# Altium project ludi_v1.PrjPcb
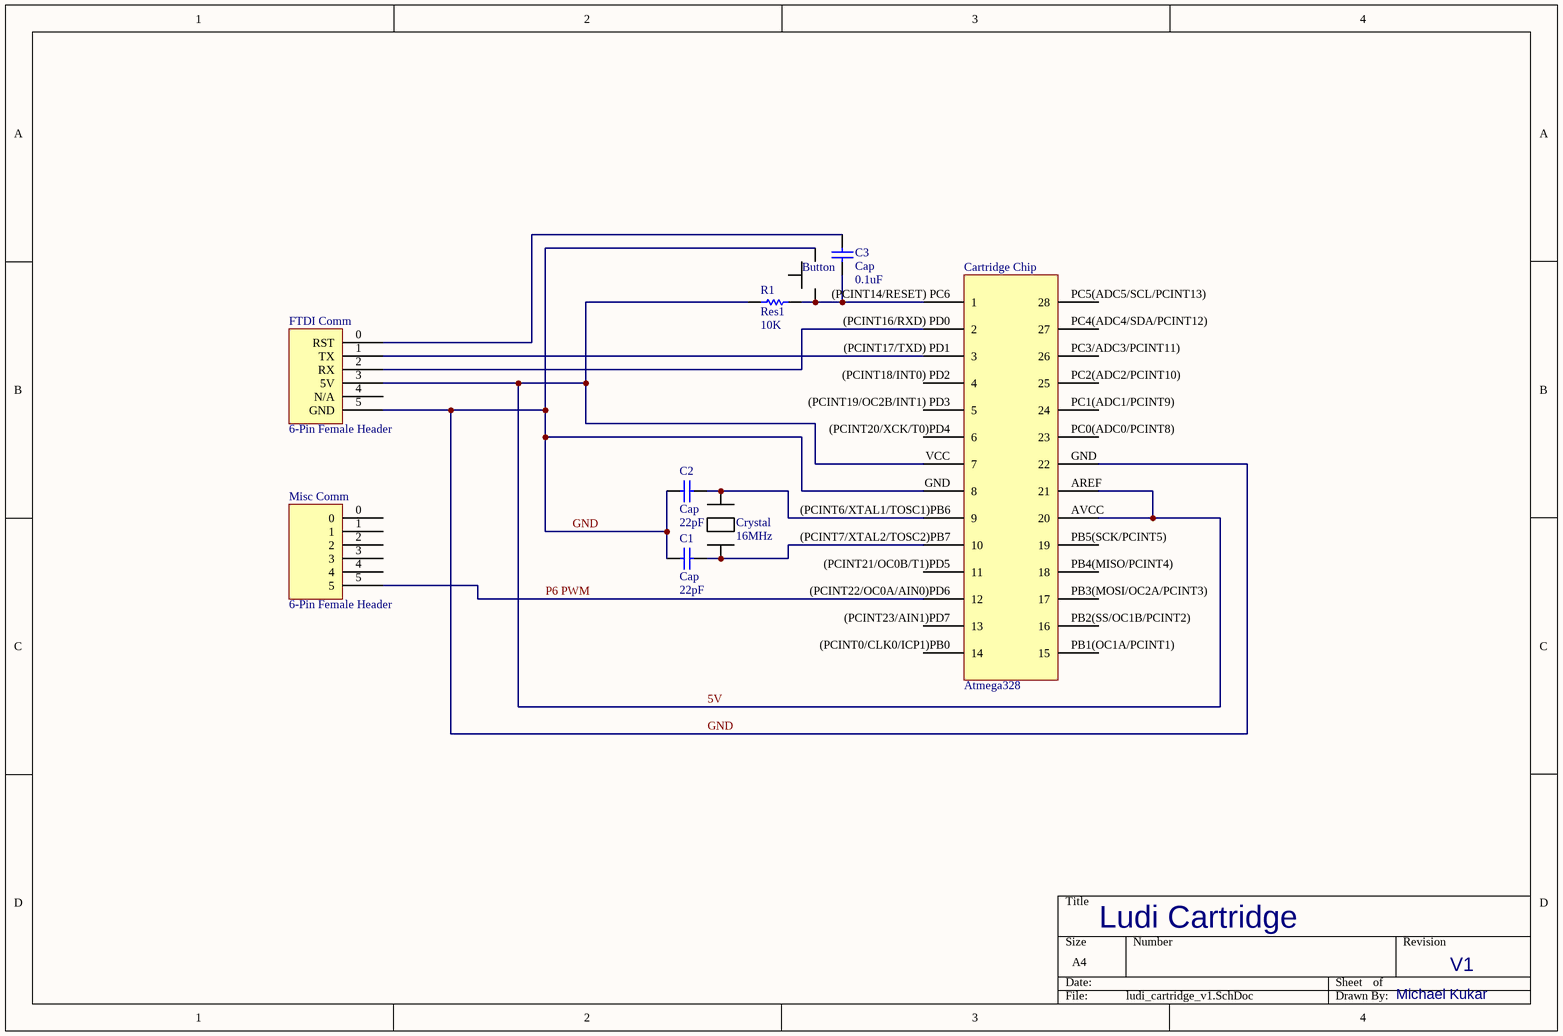
[diagram p0: ludi_cartridge_v1.SchDoc]
2 sheets, 9 parts. Net scope: global (net labels, ports and power ports of the same name join across sheets).
Sheets:
  ludi_console_v1.SchDoc
  ludi_cartridge_v1.SchDoc

## Sheet ludi_console_v1.SchDoc
size A4

## Sheet ludi_cartridge_v1.SchDoc
size A4

### Parts
*  Crystal  Frequency: 16MHz
Button  Momentary Button - Normally Open  (value not drawn)
C1  Cap  value 22pF  [RAD-0.3]
C2  Cap  value 22pF  [RAD-0.3]
C3  Cap  value 0.1uF  [RAD-0.3]
Cartridge_Chip  Atmega328
FTDI_Comm  6-Pin Female Header
Misc_Comm  6-Pin Female Header
R1  Res1  value 10K  [AXIAL-0.3]

### Nets
5V: Cartridge_Chip.AREF(21) Cartridge_Chip.AVCC(20) Cartridge_Chip.VCC(7) FTDI_Comm.3(5V) R1.1
GND: Button.1 C1.1 C2.1 Cartridge_Chip.GND(8) FTDI_Comm.5(GND)
P6 PWM: Cartridge_Chip.(PCINT22/OC0A/AIN0)PD6(12) Misc_Comm.5
Net*_0: *.0 C1.2 Cartridge_Chip.(PCINT7/XTAL2/TOSC2)PB7(10)
Net*_1: *.1 C2.2 Cartridge_Chip.(PCINT6/XTAL1/TOSC1)PB6(9)
NetButton_0: Button.0 C3.1 Cartridge_Chip.(PCINT14/RESET)_PC6(1) R1.2
NetC3_2: C3.2 FTDI_Comm.0(RST)
NetCartridge_Chip_(PCINT16/RXD) PD0: Cartridge_Chip.(PCINT16/RXD)_PD0(2) FTDI_Comm.2(RX)
NetCartridge_Chip_(PCINT17/TXD) PD1: Cartridge_Chip.(PCINT17/TXD)_PD1(3) FTDI_Comm.1(TX)

Not connected (* = marked no-connect by the designer): Cartridge_Chip (PCINT0/CLK0/ICP1)PB0(14) (PCINT18/INT0) PD2(4) (PCINT19/OC2B/INT1) PD3(5) (PCINT20/XCK/T0)PD4(6) (PCINT21/OC0B/T1)PD5(11) (PCINT23/AIN1)PD7(13) PB1(OC1A/PCINT1)(15) PB2(SS/OC1B/PCINT2)(16) PB3(MOSI/OC2A/PCINT3)(17) PB4(MISO/PCINT4)(18) PB5(SCK/PCINT5)(19) PC0(ADC0/PCINT8)(23) PC1(ADC1/PCINT9)(24) PC2(ADC2/PCINT10)(25) PC3/ADC3/PCINT11)(26) PC4(ADC4/SDA/PCINT12)(27) PC5(ADC5/SCL/PCINT13)(28); FTDI_Comm 4(N/A); Misc_Comm 0(_0) 1(_1) 2(_2) 3(_3) 4(_4)

### Notes on the sheet
- Ludi Cartridge
- V1
- Michael Kukar

### Library data of the parts
C1-C3 = Cap: Capacitor; Published: 8-Jun-2000; LatestRevisionDate: 17-Jul-2002; LatestRevisionNote: Re-released for DXP Platform.; PackageReference: RAD-0.3; Publisher: Altium Limited; PackageDescription: Radial Cap, Thru-Hole; 2 Leads; 0.3 in Pin Spacing
R1 = Res1: Resistor; Published: 8-Jun-2000; LatestRevisionDate: 17-Jul-2002; LatestRevisionNote: Re-released for DXP Platform.; PackageReference: AXIAL-0.3; Publisher: Altium Limited; PackageDescription: Axial Device, Thru-Hole; 2 Leads; 0.3 in Pin Spacing